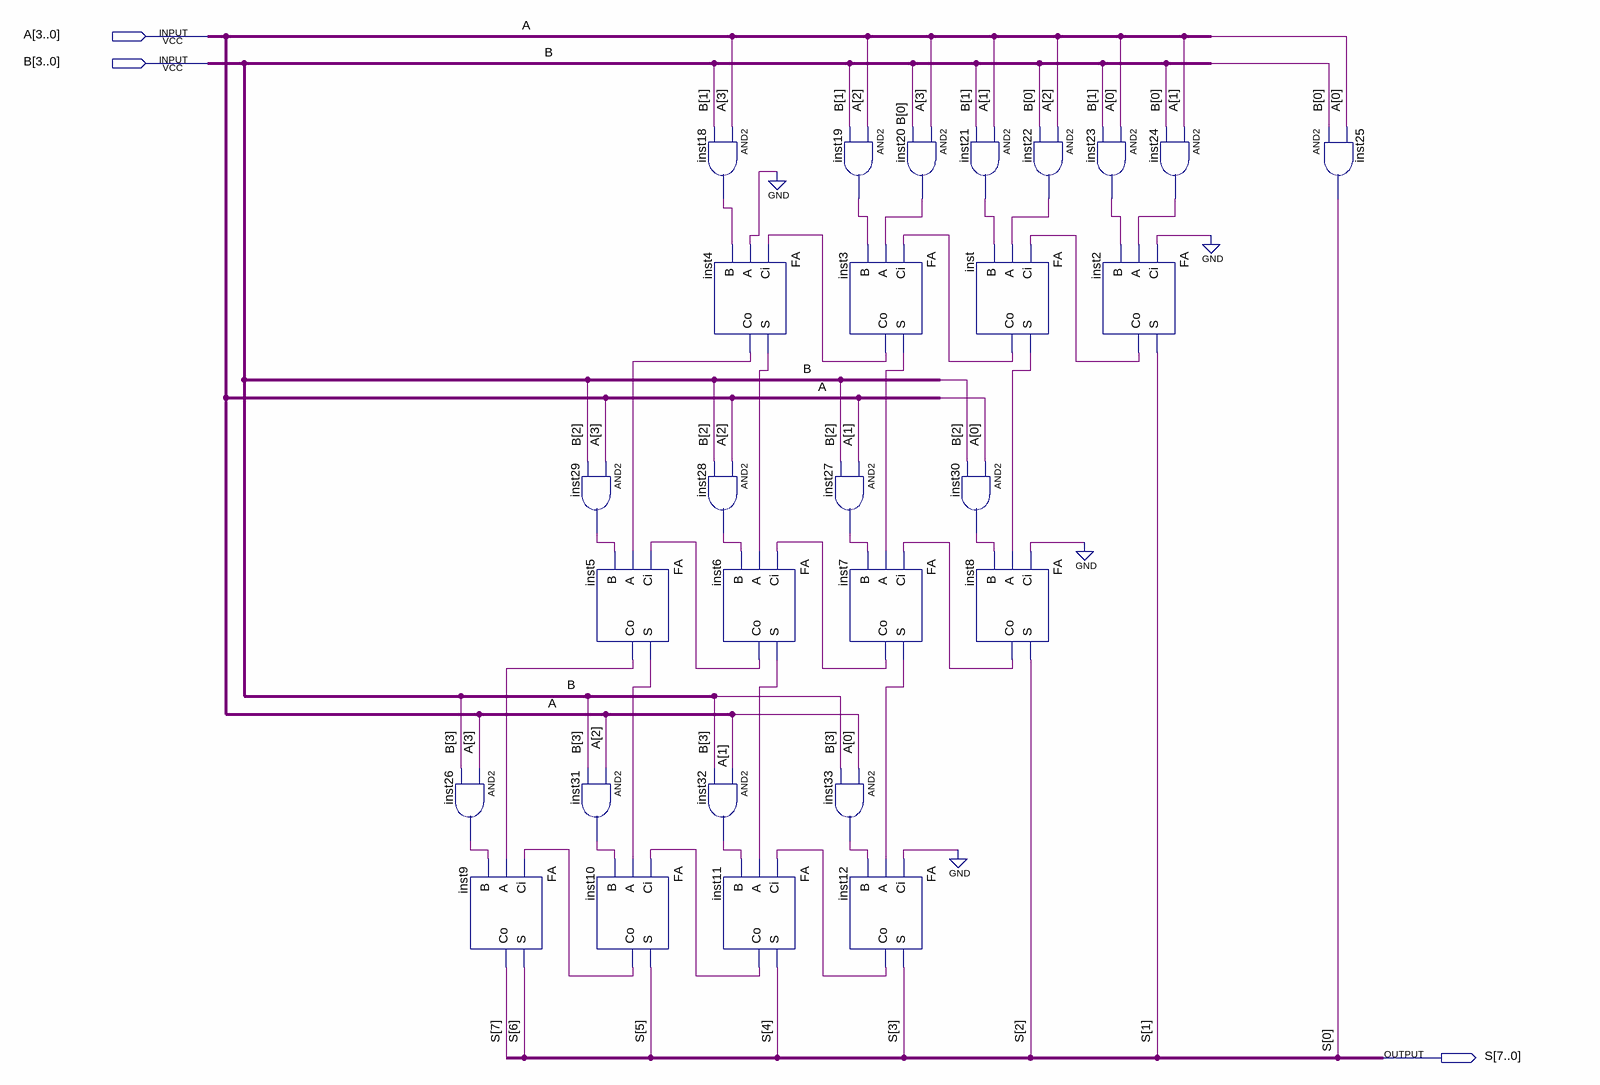
[diagram p0: schematic sheet]
// Quartus schematic multiplier.bdf as structural Verilog: 28 symbols, 3 pins
module multiplier (
  input  [3:0] A,
  input  [3:0] B,
  output [7:0] S
);

  wire inst2_co, inst3_co, inst3_s, inst4_co, inst4_s, inst5_co, inst5_s, inst6_co, inst6_s, inst7_co,
       inst7_s, inst8_co, inst10_co, inst11_co, inst12_co, inst18_out, inst19_out, inst20_out, inst21_out,
       inst22_out, inst23_out, inst24_out, inst26_out, inst27_out, inst28_out, inst29_out, inst30_out,
       inst31_out, inst32_out, inst33_out, inst_co, inst_s;

  and inst26 (inst26_out, A[3], B[3]);
  FA inst9 (.Ci(inst10_co), .A(inst5_co), .B(inst26_out), .S(S[6]), .Co(S[7]));
  and inst29 (inst29_out, A[3], B[2]);
  FA inst5 (.Ci(inst6_co), .A(inst4_co), .B(inst29_out), .S(inst5_s), .Co(inst5_co));
  and inst31 (inst31_out, A[2], B[3]);
  FA inst10 (.Ci(inst11_co), .A(inst5_s), .B(inst31_out), .S(S[5]), .Co(inst10_co));
  and inst18 (inst18_out, A[3], B[1]);
  FA inst4 (.Ci(inst3_co), .A(1'b0), .B(inst18_out), .S(inst4_s), .Co(inst4_co));
  and inst28 (inst28_out, A[2], B[2]);
  FA inst6 (.Ci(inst7_co), .A(inst4_s), .B(inst28_out), .S(inst6_s), .Co(inst6_co));
  and inst32 (inst32_out, A[1], B[3]);
  FA inst11 (.Ci(inst12_co), .A(inst6_s), .B(inst32_out), .S(S[4]), .Co(inst11_co));
  and inst27 (inst27_out, A[1], B[2]);
  and inst33 (inst33_out, A[0], B[3]);
  and inst19 (inst19_out, A[2], B[1]);
  and inst20 (inst20_out, A[3], B[0]);
  FA inst3 (.Ci(inst_co), .A(inst20_out), .B(inst19_out), .S(inst3_s), .Co(inst3_co));
  FA inst7 (.Ci(inst8_co), .A(inst3_s), .B(inst27_out), .S(inst7_s), .Co(inst7_co));
  FA inst12 (.Ci(1'b0), .A(inst7_s), .B(inst33_out), .S(S[3]), .Co(inst12_co));
  and inst21 (inst21_out, A[1], B[1]);
  FA inst (.Ci(inst2_co), .A(inst22_out), .B(inst21_out), .S(inst_s), .Co(inst_co));
  and inst30 (inst30_out, A[0], B[2]);
  FA inst8 (.Ci(1'b0), .A(inst_s), .B(inst30_out), .S(S[2]), .Co(inst8_co));
  and inst22 (inst22_out, A[2], B[0]);
  and inst23 (inst23_out, A[0], B[1]);
  FA inst2 (.Ci(1'b0), .A(inst24_out), .B(inst23_out), .S(S[1]), .Co(inst2_co));
  and inst24 (inst24_out, A[1], B[0]);
  and inst25 (S[0], B[0], A[0]);
endmodule
